# Altium schematic sheet NODE 1.1.SchDoc
size A
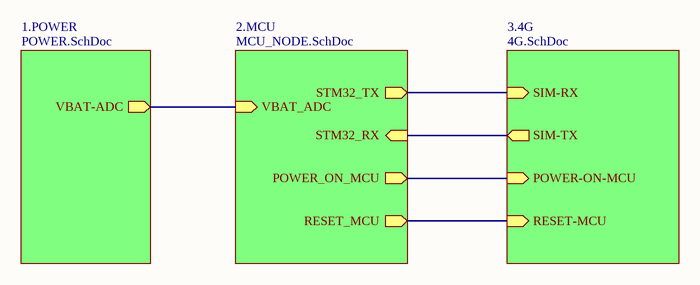
[diagram p0: NODE 1.1.SchDoc]

## Sub-sheets
1.POWER = POWER.SchDoc: VBAT-ADC (out)
2.MCU = MCU_NODE.SchDoc: VBAT_ADC (in), STM32_TX (out), STM32_RX (in), POWER_ON_MCU (out), RESET_MCU (out)
3.4G = 4G.SchDoc: SIM-RX (in), SIM-TX (out), POWER-ON-MCU (in), RESET-MCU (in)

## Nets
(unnamed): sheet 1.POWER/VBAT-ADC, sheet 2.MCU/VBAT_ADC
(unnamed): sheet 2.MCU/STM32_TX, sheet 3.4G/SIM-RX
(unnamed): sheet 2.MCU/STM32_RX, sheet 3.4G/SIM-TX
(unnamed): sheet 2.MCU/POWER_ON_MCU, sheet 3.4G/POWER-ON-MCU
(unnamed): sheet 2.MCU/RESET_MCU, sheet 3.4G/RESET-MCU